# Altium schematic sheet esp32_c6_a1_motor_drive.SchDoc: Motor Drives
size A3; SheetNumber: 3; SheetTotal: 5
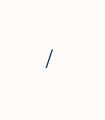
[diagram p0: esp32_c6_a1_motor_drive.SchDoc]

## Notes on the sheet
- /